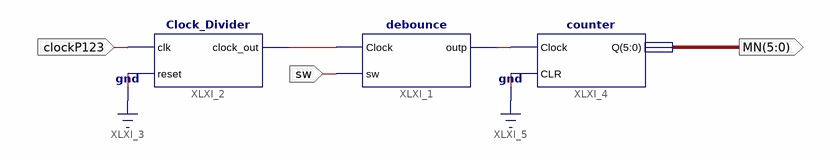
[diagram p0: schematic sheet 1]
// Xilinx ISE schematic testdeb.sch (spartan6) as structural Verilog: 3 symbols, 3 ports
module testdeb (
  input  sw,
  input  clockP123,
  output [5:0] MN
);

  wire clk, XLXN_5;

  debounce XLXI_1 (.Clock(clk), .sw(sw), .outp(XLXN_5));
  Clock_Divider XLXI_2 (.clk(clockP123), .reset(1'b0), .clock_out(clk));
  counter XLXI_4 (.Clock(XLXN_5), .CLR(1'b0), .Q(MN));
endmodule
